# Altium project hkthon.PrjPcb
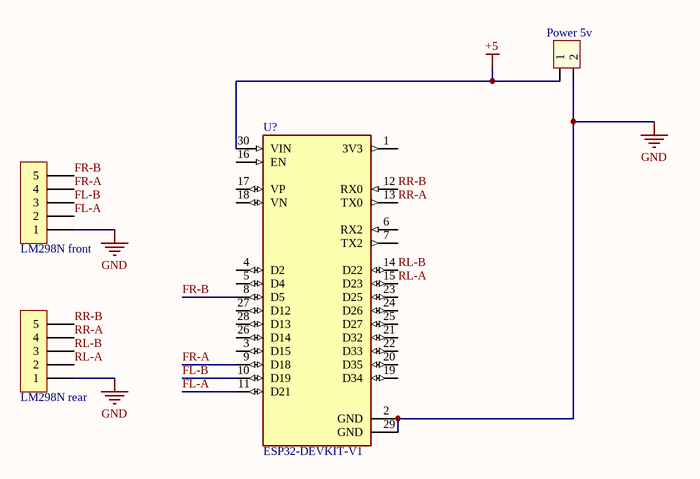
[diagram p0: Sheet1.SchDoc]
1 sheet, 4 parts. Net scope: global (net labels, ports and power ports of the same name join across sheets).
Board file: PCB1.PcbDoc

## Sheet Sheet1.SchDoc
size A; SheetNumber: 1; SheetTotal: 1

### Parts
(Parts that share a designator on the sheet are numbered #1, #2 ... from top to bottom, then left to right.)
H?#1  Power 5v  [Header 2P DC 2.54]
H?#2  LM298N front  [XH2.54M-5]
H?#3  LM298N rear  [XH2.54M-5]
U?  ESP32-DEVKIT-V1  [MODULE_ESP32_DEVKIT_V1]

### Nets
+5: H?#1.1 U?.30(VIN)
GND: H?#1.2 H?#2.1 H?#3.1 U?.2(GND) U?.29(GND)
FL-A: H?#2.2 U?.11(D21)
FL-B: H?#2.3 U?.10(D19)
FR-A: H?#2.4 U?.9(D18)
FR-B: H?#2.5 U?.8(D5)
RL-A: H?#3.2 U?.15(D23)
RL-B: H?#3.3 U?.14(D22)
RR-A: H?#3.4 U?.13(TX0)
RR-B: H?#3.5 U?.12(RX0)

Not connected (* = marked no-connect by the designer): U? 1(3V3) 3(D15) 4(D2) 5(D4) 6(RX2) 7(TX2) 16(EN) 17(VP) 18(VN) 19(D34) 20(D35) 21(D32) 22(D33) 23(D25) 24(D26) 25(D27) 26(D14) 27(D12) 28(D13)

### Library data of the parts
H?#1 = Header 2P 2.54 Duc Cong: Cắm; Ten_Linh_Kien: Header 2P XH2.54-2P Đực Cong; Don_Vi: Con; Ma_Hang: MH002852; Chung_Loai: Cắm
H?#2 H?#3 = Header 5P 2.54 Duc Thang: Cắm; Ten_Linh_Kien: Header 5P XH2.54-5P Đực Thẳng; Don_Vi: Con; Ma_Hang: MH001298; Chung_Loai: Cắm
U? = ESP32-DEVKIT-V1: Dual core, Wi-Fi: 2.4 GHz up to 150 Mbits/s,BLE (Bluetooth Low Energy) and legacy Bluetooth, 32 bits, Up to 240 MHz; MF: Do it; Price: None; Availability: Not in stock; Package: None; MP: ESP32-DEVKIT-V1; Value: *; SnapEDA_Link: https://www.snapeda.com/parts/ESP32-DEVKIT-V1/Do+it/view-part/?ref=snap; Check_prices: https://www.snapeda.com/parts/ESP32-DEVKIT-V1/Do+it/view-part/?ref=eda